# Altium schematic sheet Safety_2019_V_3_0_BRAKE_LIGHT.SchDoc
size A
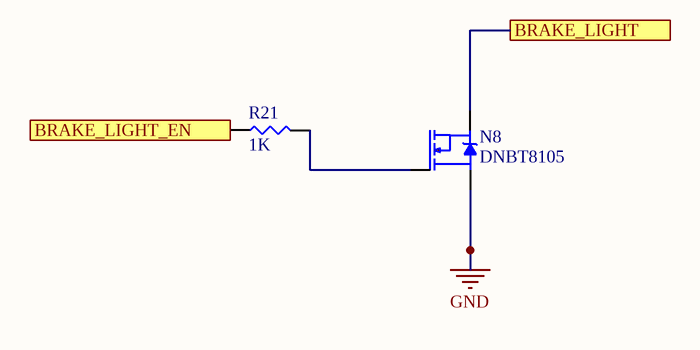
[diagram p0: Safety_2019_V_3_0_BRAKE_LIGHT.SchDoc]

## Parts
N8  DNBT8105  [SOT23]
R21  1K  [RES-0603]

## Ports
BRAKE_LIGHT, BRAKE_LIGHT_EN

## Nets
GND: N8.2(S)
BRAKE_LIGHT: N8.3(D) ; port BRAKE_LIGHT
BRAKE_LIGHT_EN: R21.1 ; port BRAKE_LIGHT_EN
NetN8_1: N8.1(G) R21.2

## Library data of the parts
N8 = NMOS-SOT23
R21 = RES-0603